# EasyEDA Pro project KT710GB.epro

# Schematic Schematic1
Create Date: 2022-10-18; Page Name: P1; Project Name: GPSTEST; Schematic Name: Schematic1; Update Date: 2024-02-03; Drawed: BI1IZF
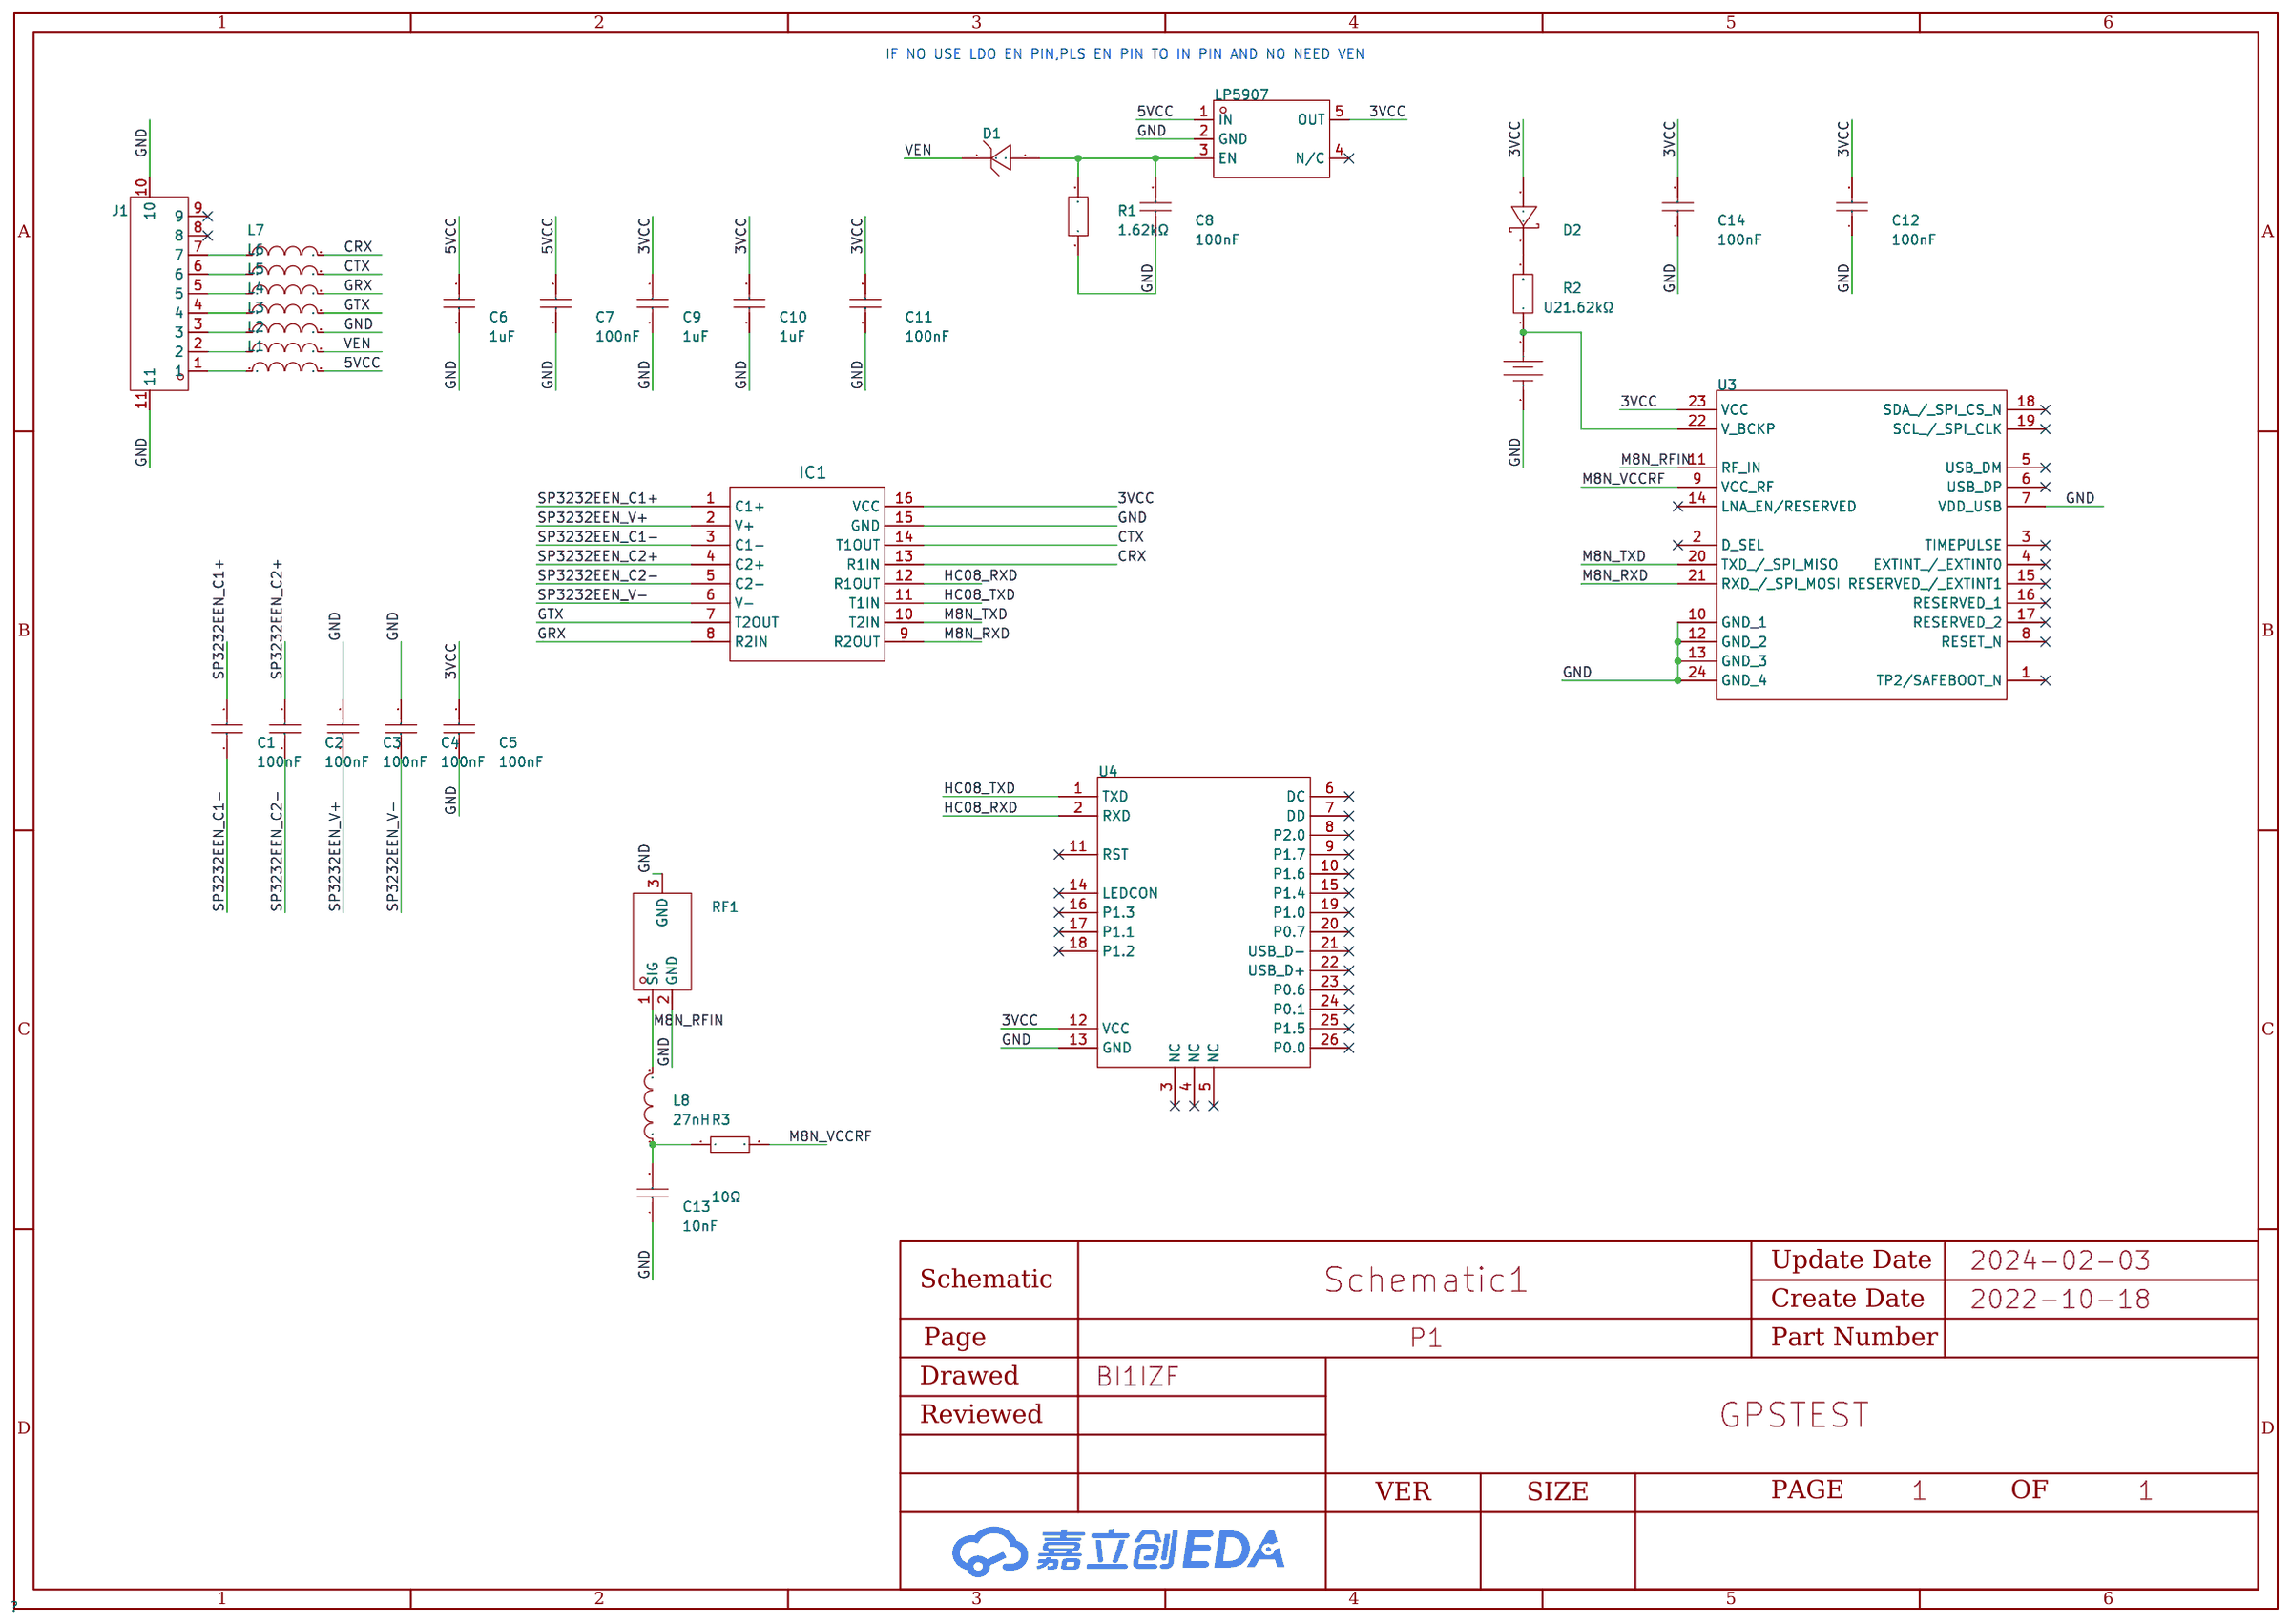
[diagram p0: schematic sheet]

## Parts
C1  100nF  [C0603]
C2  100nF  [C0603]
C3  100nF  [C0603]
C4  100nF  [C0603]
C5  100nF  [C0603]
C6  1uF  [C0603]
C7  100nF  [C0603]
C8  100nF  [C0603]
C9  1uF  [C0603]
C10  1uF  [C0603]
C11  100nF  [C0603]
C12  100nF  [C0603]
C13  10nF  [C0603]
C14  100nF  [C0603]
D1  BZT52C2V0T-7  [SOD-523_L1.2-W0.8-LS1.6-RD]
D2  CUS10S30,H3F  [SOD-323_L1.8-W1.3-LS2.5-RD]
IC1  SP3232EEN-L/TR  [SOIC-16_L9.9-W3.9-P1.27-LS6.0-BL]
J1  -  [PH2.0-9P]
L1  BLM18AG601SN1D  [L0603]
L2  BLM18AG601SN1D  [L0603]
L3  BLM18AG601SN1D  [L0603]
L4  BLM18AG601SN1D  [L0603]
L5  BLM18AG601SN1D  [L0603]
L6  BLM18AG601SN1D  [L0603]
L7  BLM18AG601SN1D  [L0603]
L8  27nH  [L0603]
LP5907  LP5907MFX-3.3/NOPB  [SOT-23-5_L3.0-W1.7-P0.95-LS2.8-BR]
R1  1.62kΩ  [R0603]
R2  1.62kΩ  [R0603]
R3  10Ω  [R0402]
RF1  BWIPX-1-001E  [IPEX-SMD_BWIPX-1-001E]
U2  MS621FE-FL11E  [CAP-SMD_FL11E]
U3  NEO-M8N  [BI1IZF_NEO-M8]
U4  HC08  [BI1IZF_HC08SMD26]

## Library data of the parts
C1-C5 C7 C8 C11 C12 C14 = 0603B104K500NT: 容值:100nF;精度:±10%;额定电压:50V;材质(温度系数):X7R;; LCSC Part Name: 100nF ±10% 50V; Supplier Part: C30926; Manufacturer: FH(风华); Supplier Footprint: 0603; JLCPCB Part Class: 扩展库; Datasheet: https://atta.szlcsc.com/upload/public/pdf/source/20200305/C486355_26A10D38EF8C2A5C37091D0039909270.pdf; Supplier: LCSC; Tolerance: ±10%; Voltage Rated: 50V; Temperature Coefficient: X7R
C6 C9 C10 = 0603B105K250NT: 容值:1uF;精度:±10%;额定电压:25V;材质(温度系数):X7R;; LCSC Part Name: 1uF ±10% 25V; Supplier Part: C59302; Manufacturer: FH(风华); Supplier Footprint: 0603; JLCPCB Part Class: 扩展库; Datasheet: https://atta.szlcsc.com/upload/public/pdf/source/20200305/C486355_26A10D38EF8C2A5C37091D0039909270.pdf; Supplier: LCSC; Tolerance: ±10%; Voltage Rated: 25V; Temperature Coefficient: X7R
C13 = 0603B103K500NT: 容值:10nF;精度:±10%;额定电压:50V;材质(温度系数):X7R;; LCSC Part Name: 10nF ±10% 50V; Supplier Part: C57112; Manufacturer: FH(风华); Supplier Footprint: 0603; JLCPCB Part Class: 基础库; Datasheet: https://atta.szlcsc.com/upload/public/pdf/source/20200305/C486355_26A10D38EF8C2A5C37091D0039909270.pdf; Supplier: LCSC; Tolerance: ±10%; Voltage Rated: 50V; Temperature Coefficient: X7R
D1 = BZT52C2V0T-7: 二极管配置:独立式;稳压值(标称值):2V;稳压值(范围):1.91V~2.09V;功率:300mW;精度:±5%;; Supplier Part: C460791; Manufacturer: DIODES(美台); Supplier Footprint: SOD-523; JLCPCB Part Class: 扩展库; Datasheet: https://atta.szlcsc.com/upload/public/pdf/source/20200113/C481693_B0458AE7F7BA3984BC75A35140E078AE.pdf; Supplier: LCSC; Diode Configuration: 独立式; Zener Voltage (Nom): 2V; Reverse Leakage Current (Ir): 150uA@1V; Zener Voltage (Range): 1.91V~2.09V; Power Dissipation: 300mW; Zener Impedance (Zzt): 100Ω; Tolerance: ±5%
D2 = CUS10S30,H3F: 正向压降(Vf):230mV@100mA;直流反向耐压(Vr):30V;平均整流电流(Io):1A;; LCSC Part Name: 电压:30V 电流:1A; Supplier Part: C146335; Manufacturer: TOSHIBA(东芝); Supplier Footprint: SC-76(SOD-323); JLCPCB Part Class: Extended Part; Datasheet: https://atta.szlcsc.com/upload/public/pdf/source/20171211/C146335_15129763734771175369.pdf; Supplier: LCSC; Forward Voltage (Vf@If): 230mV@100mA; Reverse Voltage (Vr): 30V; Average Rectified Current (Io): 1A; Reverse Leakage Current (Ir): 500uA@30V
IC1 = SP3232EEN-L/TR: Supplier: LCSC; Manufacturer: EXAR; Supplier Part: C9378; JLCPCB Part Class: Extended Part
J1 = PH2.0-9P_1
L1-L7 = BLM18AG601SN1D: 标称阻抗@测试频率:600Ω@100MHz;误差:±25%;直流电阻(RDC):380mΩ;; LCSC Part Name: 单路 0603磁珠 阻抗600Ω@100MHz; Supplier Part: C19330; Manufacturer: muRata(村田); Supplier Footprint: 0603; JLCPCB Part Class: 扩展库; Datasheet: https://atta.szlcsc.com/upload/public/pdf/source/20180329/C160981_FD3C2D2622A377E203B89F4AA32B0741.pdf; Supplier: LCSC; Impedance @ Frequency: 600Ω@100MHz; Tolerance: ±25%; DC Resistance: 380mΩ; Current Rating: 500mA; Circuits: 1
L8 = LQG18HN27NJ00D: 电感值:27nH;精度:±5%;额定电流:500mA;饱和电流(Isat):-;直流电阻(DCR):540mΩ;; LCSC Part Name: 27nH ±5%; Supplier Part: C162550; Manufacturer: muRata(村田); Supplier Footprint: 0603; JLCPCB Part Class: 扩展库; Datasheet: https://atta.szlcsc.com/upload/public/pdf/source/20190301/C337910_27DA25781C95F885577870A93A746ADF.pdf; Supplier: LCSC; Tolerance: ±5%; Rated Current: 500mA; DC Resistance (DCR): 540mΩ; Q @ Freq: 12@100MHz; Frequency - Self Resonant: 2GHz; Type: 叠层电感
LP5907 = LP5907MFX-3.3/NOPB: 输出类型:固定;最大输入电压:5.5V;输出电压:3.3V;最大输出电流:250mA;电源纹波抑制比(PSRR):90dB;输出极性:正极;; LCSC Part Name: 输入5.5V 输出3.3V 250mA; Supplier Part: C80670; Manufacturer: TI(德州仪器); Supplier Footprint: SOT-23-5; JLCPCB Part Class: 扩展库; Datasheet: https://www.ti.com/cn/lit/gpn/lp5907; Supplier: LCSC; Output Type: 固定; Maximum Input Voltage: 5.5V; Output Voltage: 3.3V; MAX Output Current: 250mA; Power Supply Rejection Ratio (PSRR): 90dB; Dropout Voltage: 250mV@(250mA); standby current: 25uA; Operating Temperature: -40℃~+125℃; Output Polarity: 正极; Number of Outputs: 1
R1 R2 = RK73H1JTTD1621F: 电阻类型:厚膜电阻;阻值:1.62kΩ;精度:±1%;功率:100mW;温度系数:±100ppm/℃;; LCSC Part Name: 厚膜电阻 1.62kΩ ±1% 100mW; Supplier Part: C782215; Manufacturer: KOA; Supplier Footprint: 0603; JLCPCB Part Class: 扩展库; Datasheet: https://atta.szlcsc.com/upload/public/pdf/source/20200909/C782215_6219DB2A5613D888C306C545AA8BE8B8.pdf; Supplier: LCSC; Type: 厚膜电阻; Tolerance: ±1%; Power(Watts): 100mW; Temperature Coefficient: ±100ppm/℃; Operating Temperature Range: -55℃~+155℃
R3 = RK73H1ETTP10R0F: 电阻类型:厚膜电阻;阻值:10Ω;精度:±1%;功率:100mW;最大工作电压:75V;温度系数:±100ppm/℃;; LCSC Part Name: 厚膜电阻 10Ω ±1% 100mW; Supplier Part: C173373; Manufacturer: KOA; Supplier Footprint: 0402; JLCPCB Part Class: 扩展库; Datasheet: https://atta.szlcsc.com/upload/public/pdf/source/20190516/C346145_73DC9C40D36D5A63BE57BD2EFB7F1781.pdf; Supplier: LCSC; Type: 厚膜电阻; Tolerance: ±1%; Power(Watts): 100mW; Overload Voltage (Max): 75V; Temperature Coefficient: ±100ppm/℃; Operating Temperature Range: -55℃~+155℃
RF1 = BWIPX-1-001E: 连接器类型:板端;接口类型:内针;端口数量:1;接口直径:-;接口长度/高度:-;频率-最大值:6GHz;射频系列:IPEX;阻抗:50Ω;样式:-;工作温度范围:-;; LCSC Part Name: IPEX 内针; Supplier Part: C496552; Manufacturer: BAT WIRELESS(蝙蝠无线); Supplier Footprint: SMD; JLCPCB Part Class: 扩展库; Datasheet: https://atta.szlcsc.com/upload/public/pdf/source/20201223/C496552_05E5A9956EAE1A8819C5051D085B1DED.pdf; Supplier: LCSC; Connector Type: 板端; Interface Type: 内针; Number of Ports: 1; Frequency-Max: 6GHz; RF Series: IPEX; Impedance: 50Ω
U2 = MS621FE-FL11E: 3.3V可充电纽扣电池 5.5mAH; Supplier Part: C80909; Manufacturer: Seiko(精工); Supplier Footprint: FL11E; JLCPCB Part Class: Extended Part; Datasheet: https://atta.szlcsc.com/upload/public/pdf/source/20170818/C80909_1503051330396895396.pdf; Supplier: LCSC
U3 = BI1IZF_NEO-M8N-0-10
U4 = BI1IZF_HC08: HC08蓝牙芯片屏蔽版

## Nets
3VCC: C5.2 C9.2 C10.2 C11.2 C12.2 C14.2 D2.2(A) IC1.16(VCC) LP5907.5(OUT) U3.23(VCC) U4.12(VCC)
5VCC: C6.2 C7.2 L1.2 LP5907.1(IN)
GND: C3.2 C4.2 C5.1 C6.1 C7.1 C8.1 C9.1 C10.1 C11.1 C12.1 C13.1 C14.1 IC1.15(GND) J1.10 J1.11 L3.2 LP5907.2(GND) R1.1 RF1.2(GND) RF1.3(GND) U2.2(-) U3.7(VDD_USB) U3.10(GND_1) U3.12(GND_2) U3.13(GND_3) U3.24(GND_4) U4.13(GND)
CRX: IC1.13(R1IN) L7.2
CTX: IC1.14(T1OUT) L6.2
GRX: IC1.8(R2IN) L5.2
GTX: IC1.7(T2OUT) L4.2
HC08_RXD: IC1.12(R1OUT) U4.2(RXD)
HC08_TXD: IC1.11(T1IN) U4.1(TXD)
M8N_RFIN: L8.2 RF1.1(SIG) U3.11(RF_IN)
M8N_RXD: IC1.9(R2OUT) U3.21(RXD_/_SPI_MOSI)
M8N_TXD: IC1.10(T2IN) U3.20(TXD_/_SPI_MISO)
M8N_VCCRF: R3.2 U3.9(VCC_RF)
SP3232EEN_C1+: C1.2 IC1.1(C1+)
SP3232EEN_C1-: C1.1 IC1.3(C1-)
SP3232EEN_C2+: C2.2 IC1.4(C2+)
SP3232EEN_C2-: C2.1 IC1.5(C2-)
SP3232EEN_V+: C3.1 IC1.2(V+)
SP3232EEN_V-: C4.1 IC1.6(V-)
VEN: D1.1 L2.2
$1N29586: J1.1 L1.1
$1N29589: J1.2 L2.1
$1N29592: J1.3 L3.1
$1N29595: J1.4 L4.1
$1N29598: J1.5 L5.1
$1N29601: J1.6 L6.1
$1N29604: J1.7 L7.1
$1N31674: C8.2 D1.2 LP5907.3(EN) R1.2
$1N31799: D2.1(K) R2.2
$1N31803: R2.1 U2.1(+) U3.22(V_BCKP)
$1N31982: C13.2 L8.1 R3.1

Not connected (* = marked no-connect by the designer): J1 8* 9*; LP5907 4(N/C)*; U3 1(TP2/SAFEBOOT_N)* 2(D_SEL)* 3(TIMEPULSE)* 4(EXTINT_/_EXTINT0)* 5(USB_DM)* 6(USB_DP)* 8(RESET_N)* 14(LNA_EN/RESERVED)* 15(RESERVED_/_EXTINT1)* 16(RESERVED_1)* 17(RESERVED_2)* 18(SDA_/_SPI_CS_N)* 19(SCL_/_SPI_CLK)*; U4 3(NC)* 4(NC)* 5(NC)* 6(DC)* 7(DD)* 8(P2.0)* 9(P1.7)* 10(P1.6)* 11(RST)* 14(LEDCON)* 15(P1.4)* 16(P1.3)* 17(P1.1)* 18(P1.2)* 19(P1.0)* 20(P0.7)* 21(USB_D-)* 22(USB_D+)* 23(P0.6)* 24(P0.1)* 25(P1.5)* 26(P0.0)*

## Notes on the sheet
- IF NO USE LDO EN PIN,PLS EN PIN TO IN PIN AND NO NEED VEN

# Board PCB1
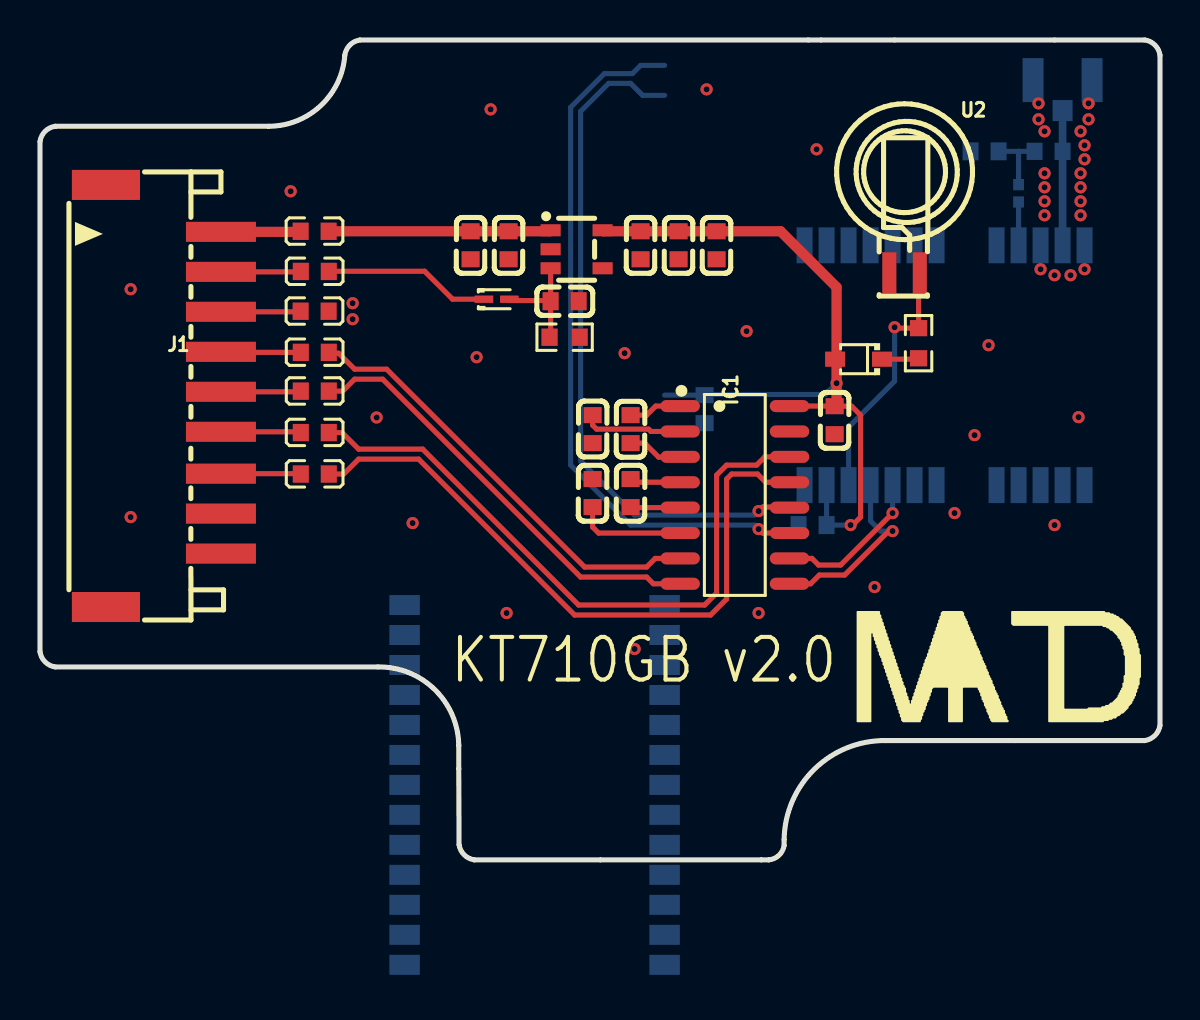
[diagram p1: board, top side]
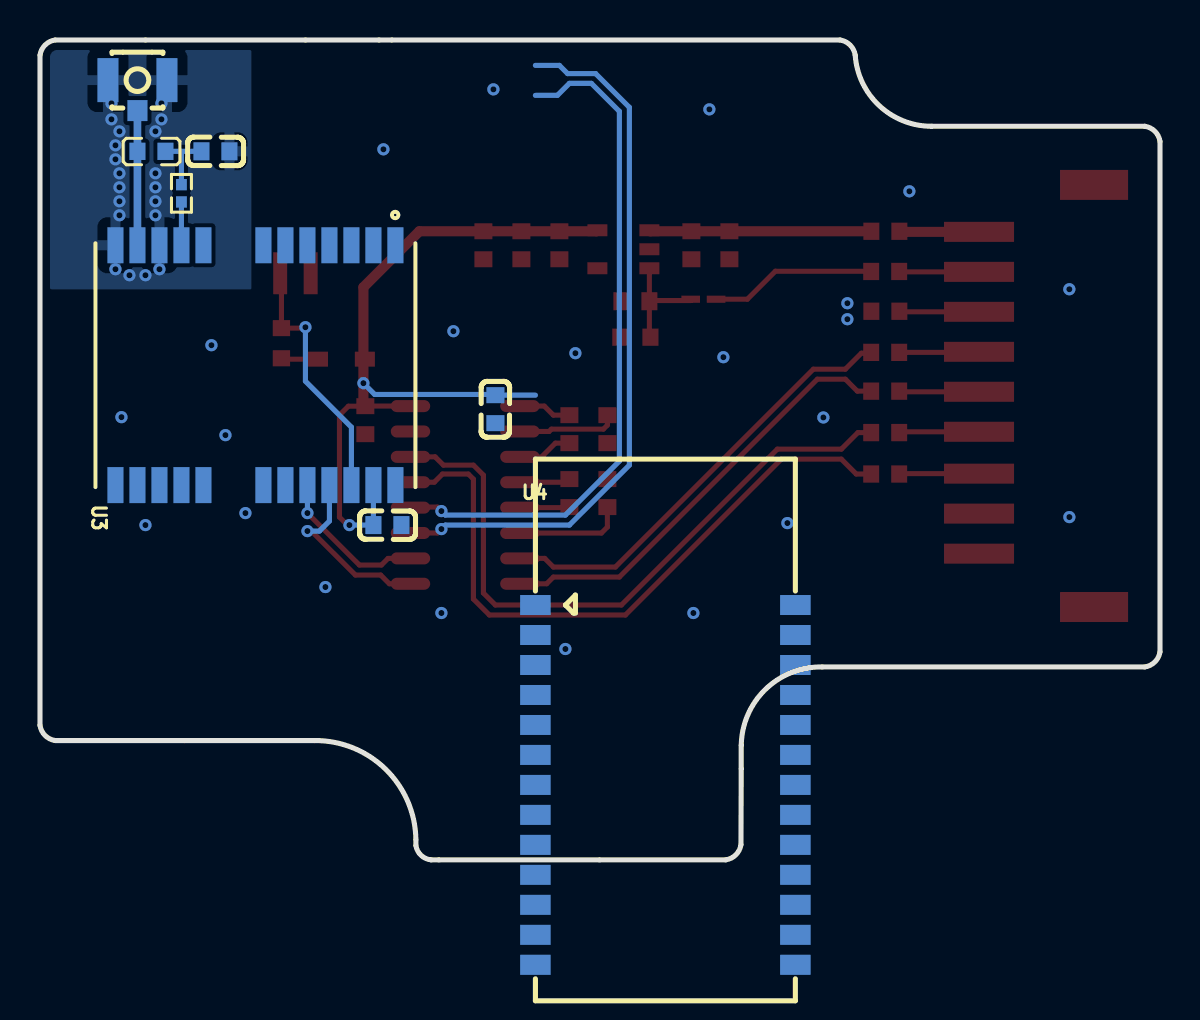
[diagram p2: board, bottom side, seen from below]

Outline 56.01 x 41.02 mm; copper layers: Top Layer, Inner1, Inner2, Bottom Layer. Coordinates in mm from the lower left corner of the outline.
Outline path: 0,35.94 arc(0.25,36.45) 0.76,36.7 11.43,36.7 arc(14.04,37.73) 15.24,40.26 arc(15.5,40.77) 16,41.02 55.25,41.02 arc(55.75,40.77) 56.01,40.26 56.01,6.73 arc(55.75,6.22) 55.25,5.97 42.29,5.97 arc(38.73,4.54) 37.21,1.02 37.21,0.72 arc(36.95,0.23) 36.45,0 21.72,0 arc(21.21,0.25) 20.95,0.76 20.94,4.55 20.94,5.72 arc(19.73,8.53) 16.89,9.65 0.76,9.65 arc(0.25,9.91) 0,10.41 0,35.94
Stack: Top Layer 0.035mm 外层铜厚1oz / Dielectric1 0.2104mm 7628 RC49% 8.6mil / Inner1 0.0152mm 内层铜厚 / Dielectric2 1.065mm 1.1mm H/HOZ 含铜 / Inner2 0.0152mm 内层铜厚 / Dielectric3 0.2104mm 7628 RC49% 8.6mil / Bottom Layer 0.035mm 外层铜厚1oz

## Design rules (mm)
template: 用户自定义配置
spacing safeClearance (default): track to track 0.152, other pairs 0.152 to 0.3
track width trackWidth (default): min 0.127, default 0.254, max 2.54
differential pair differentialPair (default): width min 0.127, default 0.254, max 2.54; gap min 0.152, default 0.152
via viaSize (default): diameter min 0.5, default 0.61, max 10; hole min 0.3, default 0.305, max 5.999
pour e437 uses copperRegion1

## Placement (name value [footprint] x y rotation side)
C1  100nF  [C0603]  29.53 21.55 90 top
C2  100nF  [C0603]  29.53 18.35 90 top
C3  100nF  [C0603]  27.63 21.55 270 top
C4  100nF  [C0603]  27.63 18.35 90 top
C5  100nF  [C0603]  39.74 22 90 top
C6  1uF  [C0603]  23.43 30.75 90 top
C7  100nF  [C0603]  21.53 30.75 90 top
C8  100nF  [C0603]  26.23 27.95 180 top
C9  1uF  [C0603]  30.03 30.75 90 top
C10  1uF  [C0603]  31.93 30.75 90 top
C11  100nF  [C0603]  33.83 30.75 90 top
C12  100nF  [C0603]  38.63 16.75 0 bottom
C13  10nF  [C0603]  47.23 35.45 0 bottom
C14  100nF  [C0603]  33.23 22.55 90 bottom
D1  BZT52C2V0T-7  [SOD-523_L1.2-W0.8-LS1.6-RD]  22.83 28.05 0 top
D2  CUS10S30,H3F  [SOD-323_L1.8-W1.3-LS2.5-RD]  40.93 25.05 180 top
IC1  SP3232EEN-L/TR  [SOIC-16_L9.9-W3.9-P1.27-LS6.0-BL]  34.75 18.26 270 top
J1  -  [PH2.0-9P]  6.17 26.42 270 top
L1  BLM18AG601SN1D  [L0603]  13.73 31.45 0 top
L2  BLM18AG601SN1D  [L0603]  13.74 29.44 0 top
L3  BLM18AG601SN1D  [L0603]  13.73 27.45 0 top
L4  BLM18AG601SN1D  [L0603]  13.74 25.39 0 top
L5  BLM18AG601SN1D  [L0603]  13.74 23.45 0 top
L6  BLM18AG601SN1D  [L0603]  13.74 21.38 0 top
L7  BLM18AG601SN1D  [L0603]  13.74 19.3 0 top
L8  27nH  [L0603]  50.43 35.45 0 bottom
LP5907  LP5907MFX-3.3/NOPB  [SOT-23-5_L3.0-W1.7-P0.95-LS2.8-BR]  26.83 30.55 180 top
R1  1.62kΩ  [R0603]  26.23 26.15 180 top
R2  1.62kΩ  [R0603]  43.93 25.85 270 top
R3  10Ω  [R0402]  48.93 33.35 270 bottom
RF1  BWIPX-1-001E  [IPEX-SMD_BWIPX-1-001E]  51.13 38.25 90 bottom
U2  MS621FE-FL11E  [CAP-SMD_FL11E]  43.23 29.35 270 top
U3  NEO-M8N  [BI1IZF_NEO-M8]  45.23 24.75 90 bottom
U4  HC08  [BI1IZF_HC08SMD26]  31.23 19.95 180 bottom

## Footprints (pads in the part's own frame, mm; a bottom-side part is the same pattern mirrored in y, then rotated)
BI1IZF_HC08SMD26
  rect 1.524x1 smd: 1(0,-7.2) 2(0,-8.7) 3(0,-10.2) 4(0,-11.7) 5(0,-13.2) 6(0,-14.7) 7(0,-16.2) 8(0,-17.7) 9(0,-19.2) 10(0,-20.7) 11(0,-22.2) 12(0,-23.7) 13(0,-25.2) 14(13,-25.2) 15(13,-23.7) 16(13,-22.2) 17(13,-20.7) 18(13,-19.2) 19(13,-17.7) 20(13,-16.2) 21(13,-14.7) 22(13,-13.2) 23(13,-11.7) 24(13,-10.2) 25(13,-8.7) 26(13,-7.2)
BI1IZF_NEO-M8
  rect 1.8x0.8 smd: 1(6,-7) 2(6,-5.9) 3(6,-4.8) 4(6,-3.7) 5(6,-2.6) 6(6,-1.5) 7(6,-0.4) 8(6,2.6) 9(6,3.7) 10(6,4.8) 11(6,5.9) 12(6,7) 13(-6,7) 14(-6,5.9) 15(-6,4.8) 16(-6,3.7) 17(-6,2.6) 18(-6,-0.4) 19(-6,-1.5) 20(-6,-2.6) 21(-6,-3.7) 22(-6,-4.8) 23(-6,-5.9) 24(-6,-7)
C0603
  rect 0.8x0.9 smd: 1(-0.7,0) 2(0.7,0)
CAP-SMD_FL11E
  rect 2.1x0.7 smd: 1(0,0.762) 2(0,-0.762)
IPEX-SMD_BWIPX-1-001E
  rect 1.05x1 smd: 1(-0.762,0)
  rect 2.2x1.05 smd: 2(0.762,-1.475) 3(0.762,1.475)
L0603
  rect 0.8x0.864 smd: 1(-0.7,0) 2(0.7,0)
PH2.0-9P
  rect 1.001x3.5 smd: 1(-5.002,2.876) 2(-2.999,2.876) 3(-1.001,2.876) 4(1.001,2.876) 5(2.999,2.876) 6(5.002,2.876) 7(7.097,2.876) 8(9.095,2.876) 9(11.098,2.876)
  rect 1.501x3.401 smd: 10(-7.351,-2.876) 11(13.769,-2.876)
R0402
  rect 0.566x0.54 smd: 1(-0.433,0) 2(0.433,0)
R0603
  rect 0.806x0.864 smd: 1(-0.753,0) 2(0.753,0)
SOD-323_L1.8-W1.3-LS2.5-RD
  rect 1x0.75 smd: 1(-1.173,0) 2(1.173,0)
SOD-523_L1.2-W0.8-LS1.6-RD
  rect 0.93x0.36 smd: 1(-0.635,0) 2(0.635,0)
SOIC-16_L9.9-W3.9-P1.27-LS6.0-BL
  oval 0.602x1.971 smd: 1(-4.445,-2.736) 2(-3.175,-2.736) 3(-1.905,-2.736) 4(-0.635,-2.736) 5(0.635,-2.736) 6(1.905,-2.736) 7(3.175,-2.736) 8(4.445,-2.736) 9(4.445,2.736) 10(3.175,2.736) 11(1.905,2.736) 12(0.635,2.736) 13(-0.635,2.736) 14(-1.905,2.736) 15(-3.175,2.736) 16(-4.445,2.736)
SOT-23-5_L3.0-W1.7-P0.95-LS2.8-BR
  rect 1x0.6 smd: 1(1.3,-0.95) 2(1.3,0) 3(1.3,0.95) 4(-1.3,0.95) 5(-1.3,-0.95)

## Nets
As in the schematic.

Pads without a net: J1 8 9; LP5907 4; U3 1 2 3 4 5 6 8 14 15 16 17 18 19; U4 3 4 5 6 7 8 9 10 11 14 15 16 17 18 19 20 21 22 23 24 25 26

## Via types
v1: diameter 0.61, hole 0.305, Top Layer to Bottom Layer, 49 vias

## Routing (per net, layer and track width the routed paths; a pad name or vN(x,y) marks a point on that pad's centre or on a via; arc(x,y) is an arc through that point)
3VCC: length 40.4
  Top Layer w0.254: v1(40.53,16.75) 40.63,16.75 41.03,17.15 41.03,22.25 40.59,22.7 C5.2 39.73,22.7 37.48,22.7
  Top Layer w0.508: LP5907.5 28.18,31.45 C9.2 C10.2 C11.2 37.03,31.45 39.83,28.65 v1(39.83,23.85) 39.83,22.79 C5.2
  Bottom Layer w0.254: 31.23,23.25 C14.2 33.27,23.29 39.27,23.29 v1(39.83,23.85) ; v1(40.53,16.75) 39.43,16.75 39.33,16.85 U3.23
5VCC: length 11.1
  Top Layer w0.508: LP5907.1 25.48,31.45 C6.2 C7.2 L1.2
GND:
  vias: v1(4.53,28.55) v1(4.53,17.15) v1(12.53,33.45) v1(15.63,27.85) v1(15.63,27.05) v1(16.83,22.13) v1(18.63,16.85) v1(21.83,25.15) v1(22.53,37.55) v1(23.33,12.35) v1(29.23,25.35) v1(29.73,10.55) v1(33.33,38.55) v1(35.33,26.45) v1(35.93,12.35) v1(38.83,35.55) v1(41.73,13.65) v1(45.73,17.35) v1(46.73,21.25) v1(47.43,25.75) v1(49.93,37.85) v1(49.93,37.05) v1(50.03,29.55) v1(50.23,36.45) v1(50.23,34.35) v1(50.23,33.65) v1(50.23,32.95) v1(50.23,32.25) v1(50.73,29.25) v1(50.73,16.75) v1(51.53,29.25) v1(51.93,22.15) v1(52.03,36.45) v1(52.03,34.35) v1(52.03,33.65) v1(52.03,32.95) v1(52.03,32.25) v1(52.23,35.75) v1(52.23,35.05) v1(52.23,29.55) v1(52.43,37.85) v1(52.43,37.05)
CRX: length 33.2
  Top Layer w0.254: 37.48,18.89 36.29,18.89 35.88,19.3 34.59,19.3 34.33,19.05 34.33,13.05 33.53,12.25 26.73,12.25 18.93,20.05 15.93,20.05 15.19,19.3 L7.2
CTX: length 33.1
  Top Layer w0.254: 37.48,20.16 36.25,20.16 35.83,19.75 34.33,19.75 33.83,19.25 33.83,13.35 33.23,12.75 26.93,12.75 19.13,20.55 15.93,20.55 15.11,21.38 L6.2
GRX: length 22.1
  Top Layer w0.254: L5.2 15.14,23.45 15.73,24.05 17.13,24.05 27.03,14.15 30.33,14.15 30.67,13.81 IC1.8
GTX: length 22.2
  Top Layer w0.254: IC1.7 30.77,15.08 30.33,14.65 27.23,14.65 17.33,24.55 15.73,24.55 14.93,25.35 14.48,25.35 L4.2
HC08_RXD: length 34.3
  Top Layer w0.254: v1(35.93,17.45) 36.13,17.65 37.45,17.65 37.48,17.62
  Bottom Layer w0.254: 31.23,38.25 30.13,38.25 29.53,38.85 28.43,38.85 27.03,37.45 27.03,19.95 29.73,17.25 35.73,17.25 v1(35.93,17.45)
HC08_TXD: length 35.8
  Top Layer w0.254: v1(35.93,16.55) 36.13,16.35 37.48,16.35
  Bottom Layer w0.254: 31.23,39.75 30.03,39.75 29.62,39.34 28.22,39.34 26.53,37.65 26.53,19.75 29.53,16.75 35.73,16.75 v1(35.93,16.55)
M8N_RFIN: length 6.7
  Bottom Layer w0.381: U3.11 L8.2 RF1.1
M8N_RXD: length 9.4
  Top Layer w0.254: v1(42.63,16.45) 42.43,16.45 40.23,14.25 38.97,14.25 38.53,13.81 37.48,13.81
  Bottom Layer w0.254: U3.21 41.53,16.95 42.03,16.45 v1(42.63,16.45)
M8N_TXD: length 7.8
  Top Layer w0.254: 37.48,15.08 38.6,15.08 38.93,14.75 40.03,14.75 v1(42.63,17.35)
  Bottom Layer w0.254: v1(42.63,17.35) U3.20
M8N_VCCRF: length 2.2
  Bottom Layer w0.254: 48.93,32.92 U3.9
SP3232EEN_C1+: length 2.7
  Top Layer w0.254: C1.2 30.33,22.25 30.79,22.7 IC1.1
SP3232EEN_C1-: length 2.8
  Top Layer w0.254: C1.1 30.23,20.85 30.93,20.15 32,20.15 IC1.3
SP3232EEN_C2+: length 2.5
  Top Layer w0.254: IC1.4 29.69,18.89 C2.2
SP3232EEN_C2-: length 2.5
  Top Layer w0.254: IC1.5 29.56,17.62 C2.1
SP3232EEN_V+: length 5
  Top Layer w0.254: C3.1 27.63,21.75 27.83,21.55 30.43,21.55 30.55,21.43 IC1.2
SP3232EEN_V-: length 5.5
  Top Layer w0.254: IC1.6 32.01,16.35 27.93,16.35 27.63,16.65 C4.1
VEN: length 8.3
  Top Layer w0.254: L2.2 14.45,29.45 19.23,29.45 20.63,28.05 22.2,28.05
$1N29586: length 4
  Top Layer w0.508: L1.1 13,31.42 J1.1
$1N29589: length 4
  Top Layer w0.254: J1.2 13.02,29.42 L2.1
$1N29592: length 4
  Top Layer w0.254: L3.1 13,27.42 J1.3
$1N29595: length 4
  Top Layer w0.254: L4.1 9.08,25.39 J1.4
$1N29598: length 4
  Top Layer w0.254: J1.5 13.01,23.42 L5.1
$1N29601: length 4
  Top Layer w0.254: J1.6 12.98,21.42 13.04,21.48
$1N29604: length 4
  Top Layer w0.254: L7.1 13.02,19.32 J1.7
$1N31674: length 5.6
  Top Layer w0.254: R1.2 25.53,26.2 C8.2 ; C8.2 25.5,27.99 23.43,27.99 ; C8.2 LP5907.3
$1N31799: length 1.8
  Top Layer w0.254: D2.1 43.89,25.05 R2.2
$1N31803: length 12.8
  Top Layer w0.254: U2.1 43.93,29.29 R2.1 42.78,26.6 v1(42.73,26.65)
  Bottom Layer w0.254: U3.22 40.43,21.65 42.73,23.95 v1(42.73,26.65)
$1N31982: length 3.5
  Bottom Layer w0.254: 48.96,35.45 48.93,35.43 R3.1 ; 48.96,35.45 C13.2 ; 48.96,35.45 L8.1

## Copper pours and planes (outline as drawn; the poured copper is in the pictures)
GND on Bottom Layer: 45.44,41.02 56.01,41.02 56.01,28.54 45.44,28.54
GND on Inner1: 45.44,41.02 56.01,41.02 56.01,28.54 45.44,28.54
GND on Inner2: 45.44,41.02 56.01,41.02 56.01,28.54 45.44,28.54

## Text on the board
Top Silkscreen Layer: KT710GB v2.0
